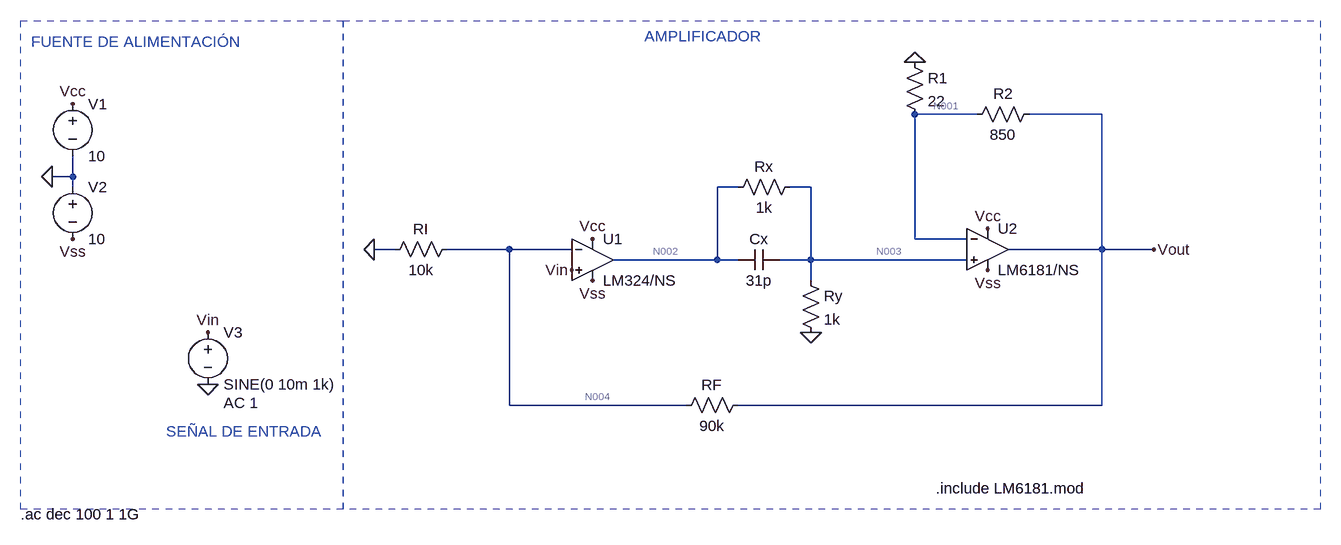
[diagram p0: schematic amp_vfa_cfa_comp.asc]
amp_vfa_cfa_comp.asc, the LTspice schematic file:
Version 4
SHEET 1 1220 680
WIRE 656 -80 560 -80
WIRE 848 -80 736 -80
WIRE -736 16 -736 -16
WIRE -736 16 -768 16
WIRE -736 32 -736 16
WIRE 288 32 256 32
WIRE 400 32 368 32
WIRE 560 112 560 -80
WIRE 640 112 560 112
WIRE -240 128 -272 128
WIRE -64 128 -160 128
WIRE 32 128 -64 128
WIRE 848 128 848 -80
WIRE 848 128 704 128
WIRE 928 128 848 128
WIRE 256 144 256 32
WIRE 256 144 96 144
WIRE 288 144 256 144
WIRE 400 144 400 32
WIRE 400 144 352 144
WIRE 640 144 400 144
WIRE 400 176 400 144
WIRE -64 368 -64 128
WIRE 208 368 -64 368
WIRE 848 368 848 128
WIRE 848 368 288 368
FLAG -272 128 0
FLAG 928 128 Vout
FLAG -736 -96 Vcc
FLAG -736 112 Vss
FLAG -528 256 Vin
FLAG -528 336 0
FLAG -768 16 0
FLAG 32 160 Vin
FLAG 64 112 Vcc
FLAG 672 96 Vcc
FLAG 64 176 Vss
FLAG 672 160 Vss
FLAG 560 -160 0
FLAG 400 256 0
SYMBOL res 304 352 R90
WINDOW 0 0 56 VBottom 2
WINDOW 3 32 56 VTop 2
SYMATTR InstName RF
SYMATTR Value 90k
SYMBOL res -144 112 R90
WINDOW 0 0 56 VBottom 2
WINDOW 3 32 56 VTop 2
SYMATTR InstName RI
SYMATTR Value 10k
SYMBOL voltage -736 -112 R0
WINDOW 123 0 0 Left 0
WINDOW 39 0 0 Left 0
SYMATTR InstName V1
SYMATTR Value 10
SYMBOL voltage -736 16 R0
WINDOW 123 0 0 Left 0
WINDOW 39 0 0 Left 0
SYMATTR InstName V2
SYMATTR Value 10
SYMBOL voltage -528 240 R0
WINDOW 123 24 124 Left 2
WINDOW 39 0 0 Left 0
SYMATTR Value2 AC 1
SYMATTR InstName V3
SYMATTR Value SINE(0 10m 1k)
SYMBOL res 752 -96 R90
WINDOW 0 0 56 VBottom 2
WINDOW 3 32 56 VTop 2
SYMATTR InstName R2
SYMATTR Value 850
SYMBOL res 544 -176 R0
SYMATTR InstName R1
SYMATTR Value 22
SYMBOL OpAmps\\opamp2 672 64 R0
SYMATTR InstName U2
SYMATTR Value LM6181/NS
SYMBOL ZZZ\\OpAmp\\LM324 64 144 R0
SYMATTR InstName U1
SYMBOL res 384 16 R90
WINDOW 0 0 56 VBottom 2
WINDOW 3 32 56 VTop 2
SYMATTR InstName Rx
SYMATTR Value 1k
SYMBOL cap 352 128 R90
WINDOW 0 0 32 VBottom 2
WINDOW 3 32 32 VTop 2
SYMATTR InstName Cx
SYMATTR Value 31p
SYMBOL res 384 160 R0
SYMATTR InstName Ry
SYMATTR Value 1k
TEXT 144 -200 Left 2 ;AMPLIFICADOR
TEXT -800 -192 Left 2 ;FUENTE DE ALIMENTACIÓN
TEXT -592 408 Left 2 ;SEÑAL DE ENTRADA
TEXT -816 536 Left 2 !.ac dec 100 1 1G
TEXT 592 496 Left 2 !.include LM6181.mod
RECTANGLE Normal -320 528 -816 -224 2
RECTANGLE Normal 1184 528 -320 -224 2

The netlist it stands for:
* amp_vfa_cfa_comp.asc
RF Vout N004 90k
RI N004 0 10k
V1 Vcc 0 10
V2 0 Vss 10
V3 Vin 0 SINE(0 10m 1k) AC 1
R2 Vout N001 850
R1 0 N001 22
XU2 N003 N001 Vcc Vss Vout LM6181/NS  ; pins In+ In- V+ V- OUT
XU1 Vin N004 Vcc Vss N002 LM324/NS  ; pins In+ In- V+ V- OUT
Rx N003 N002 1k
Cx N003 N002 31p
Ry N003 0 1k
* AMPLIFICADOR
* FUENTE DE ALIMENTACIÓN
* SEÑAL DE ENTRADA
.ac dec 100 1 1G
.include LM6181.mod
.backanno
.end

* Results of the author's LTspice run, read from the files saved beside the schematic
* Operating Point, zero values left out:
*   V(vout) = 16.58 mV
*   V(n004) = 2 mV
*   V(vcc) = 10 V
*   V(vss) = -10 V
*   V(n001) = 536.5 µV
*   V(n003) = -1.863 mV
*   V(n002) = -2.626 mV
*   I(Ry) = -1.863 µA
*   I(Rx) = 762.9 nA
*   I(R1) = -24.39 µA
*   I(R2) = 18.88 µA
*   I(Ri) = 200 nA
*   I(Rf) = 162.1 nA
*   I(V3) = 51.95 nA
*   I(V2) = -6.831 mA
*   I(V1) = -6.853 mA
*   Ix(u2:1) = 1.1 µA
*   Ix(u2:2) = -5.508 µA
*   Ix(u2:99) = 6.775 mA
*   Ix(u2:50) = -6.752 mA
*   Ix(u2:40) = -19.04 µA
*   Ix(u1:1) = -51.95 nA
*   Ix(u1:2) = -37.95 nA
*   Ix(u1:99) = 78.22 µA
*   Ix(u1:50) = -78.89 µA
*   Ix(u1:28) = 762.9 nA
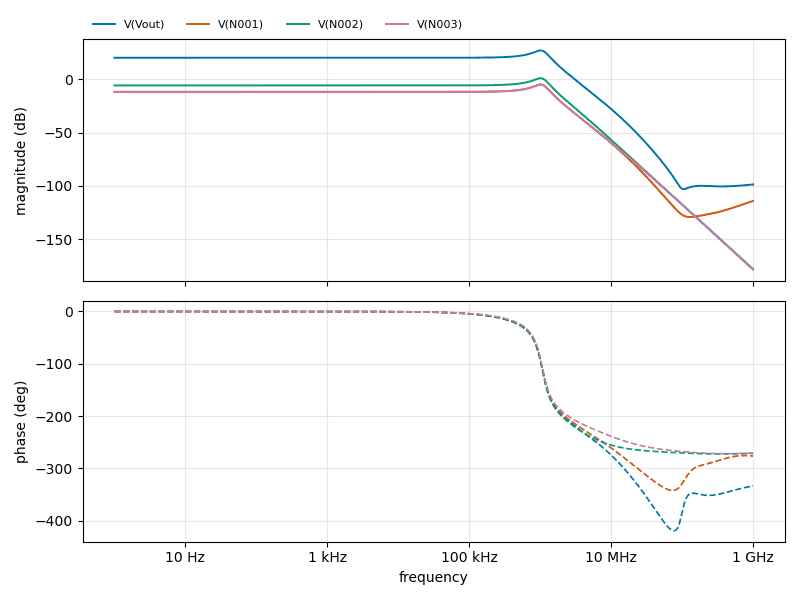
[diagram p1: AC Analysis of amp_vfa_cfa_comp.asc, plotted from the saved traces]
* AC Analysis, 1 run:
*   V(Vout): 20.00 dB at 1 Hz, -98.64 dB at 1 GHz, peak 26.90 dB at 1.023 MHz, 3 dB below the peak at 723.9 kHz and 1.23 MHz
*   V(N001): -11.96 dB at 1 Hz, -114.09 dB at 1 GHz, peak -5.05 dB at 1.023 MHz, 3 dB below the peak at 723.9 kHz and 1.23 MHz
*   V(N002): -5.92 dB at 1 Hz, -177.95 dB at 1 GHz, peak 0.87 dB at 1.023 MHz, 3 dB below the peak at 719.1 kHz and 1.228 MHz
*   V(N003): -11.95 dB at 1 Hz, -178.49 dB at 1 GHz, peak -5.03 dB at 1.023 MHz, 3 dB below the peak at 724.2 kHz and 1.23 MHz